# Altium schematic sheet USB.SchDoc
size A
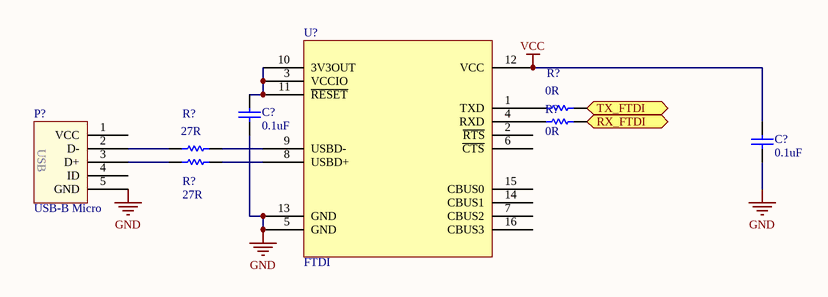
[diagram p0: USB.SchDoc]

## Parts
(Parts that share a designator on the sheet are numbered #1, #2 ... from top to bottom, then left to right.)
C?#1  value 0.1uF  [0805]  (hidden comment: Cap)
C?#2  value 0.1uF  [0805]  (hidden comment: Cap)
P?  USB-B Micro  [USB B Micro WM14338CT-ND]
R?#1  value 0R  [0805]  (hidden comment: Res1)
R?#2  value 27R  [0805]  (hidden comment: Res1)
R?#3  value 0R  [0805]  (hidden comment: Res1)
R?#4  value 27R  [0805]  (hidden comment: Res1)
U?  FTDI  [FTDI_SSOP_16]

## Ports
RX_FTDI, TX_FTDI

## Nets
GND: C?#1.1 C?#2.1 P?.5(GND) U?.5(GND) U?.13(GND)
VCC: C?#2.2 U?.12(VCC)
RX_FTDI: R?#3.1 ; port RX_FTDI
TX_FTDI: R?#1.2 ; port TX_FTDI
NetC?#1_2: C?#1.2 U?.3(VCCIO) U?.10(3V3OUT) U?.11(~{RESET})
NetP?_2: P?.2(D-) R?#2.1
NetP?_3: P?.3(D+) R?#4.1
NetR?#1_1: R?#1.1 U?.1(TXD)
NetR?#2_2: R?#2.2 U?.9(USBD-)
NetR?#3_2: R?#3.2 U?.4(RXD)
NetR?#4_2: R?#4.2 U?.8(USBD+)

Not connected (* = marked no-connect by the designer): P? 1(VCC) 4(ID); U? 2(~{RTS}) 6(~{CTS}) 7(CBUS2) 14(CBUS1) 15(CBUS0) 16(CBUS3)

## Notes on the sheet
- (in symbol USB-B Micro 4 Pad) USB

## Library data of the parts
C?#1 C?#2 = Capacitor: Chip Capacitor
P? = USB-B Micro 4 Pad: USB-B SMT Connector; Manufacturer Part No.: 0476100001; Digi-Key Part No.: WM14338CT-ND
R?#1-R?#4 = Res1: Resistor; Published: 8-Jun-2000; LatestRevisionDate: 17-Jul-2002; LatestRevisionNote: Re-released for DXP Platform.; PackageReference: AXIAL-0.3; Publisher: Altium Limited; PackageDescription: Axial Device, Thru-Hole; 2 Leads; 0.3 in Pin Spacing
U? = FTDI: USB-UART Converter; Manufacturer Part No.: FT230XS-U; Digi-Key Part No.: 768-1135-1-ND; ComponentLink1Description: Datasheet; ComponentLink1URL: http://www.ftdichip.com/Support/Documents/DataSheets/ICs/DS_FT230X.pdf